# EAGLE schematic esp_thermometer (EAGLE 9.3.2)
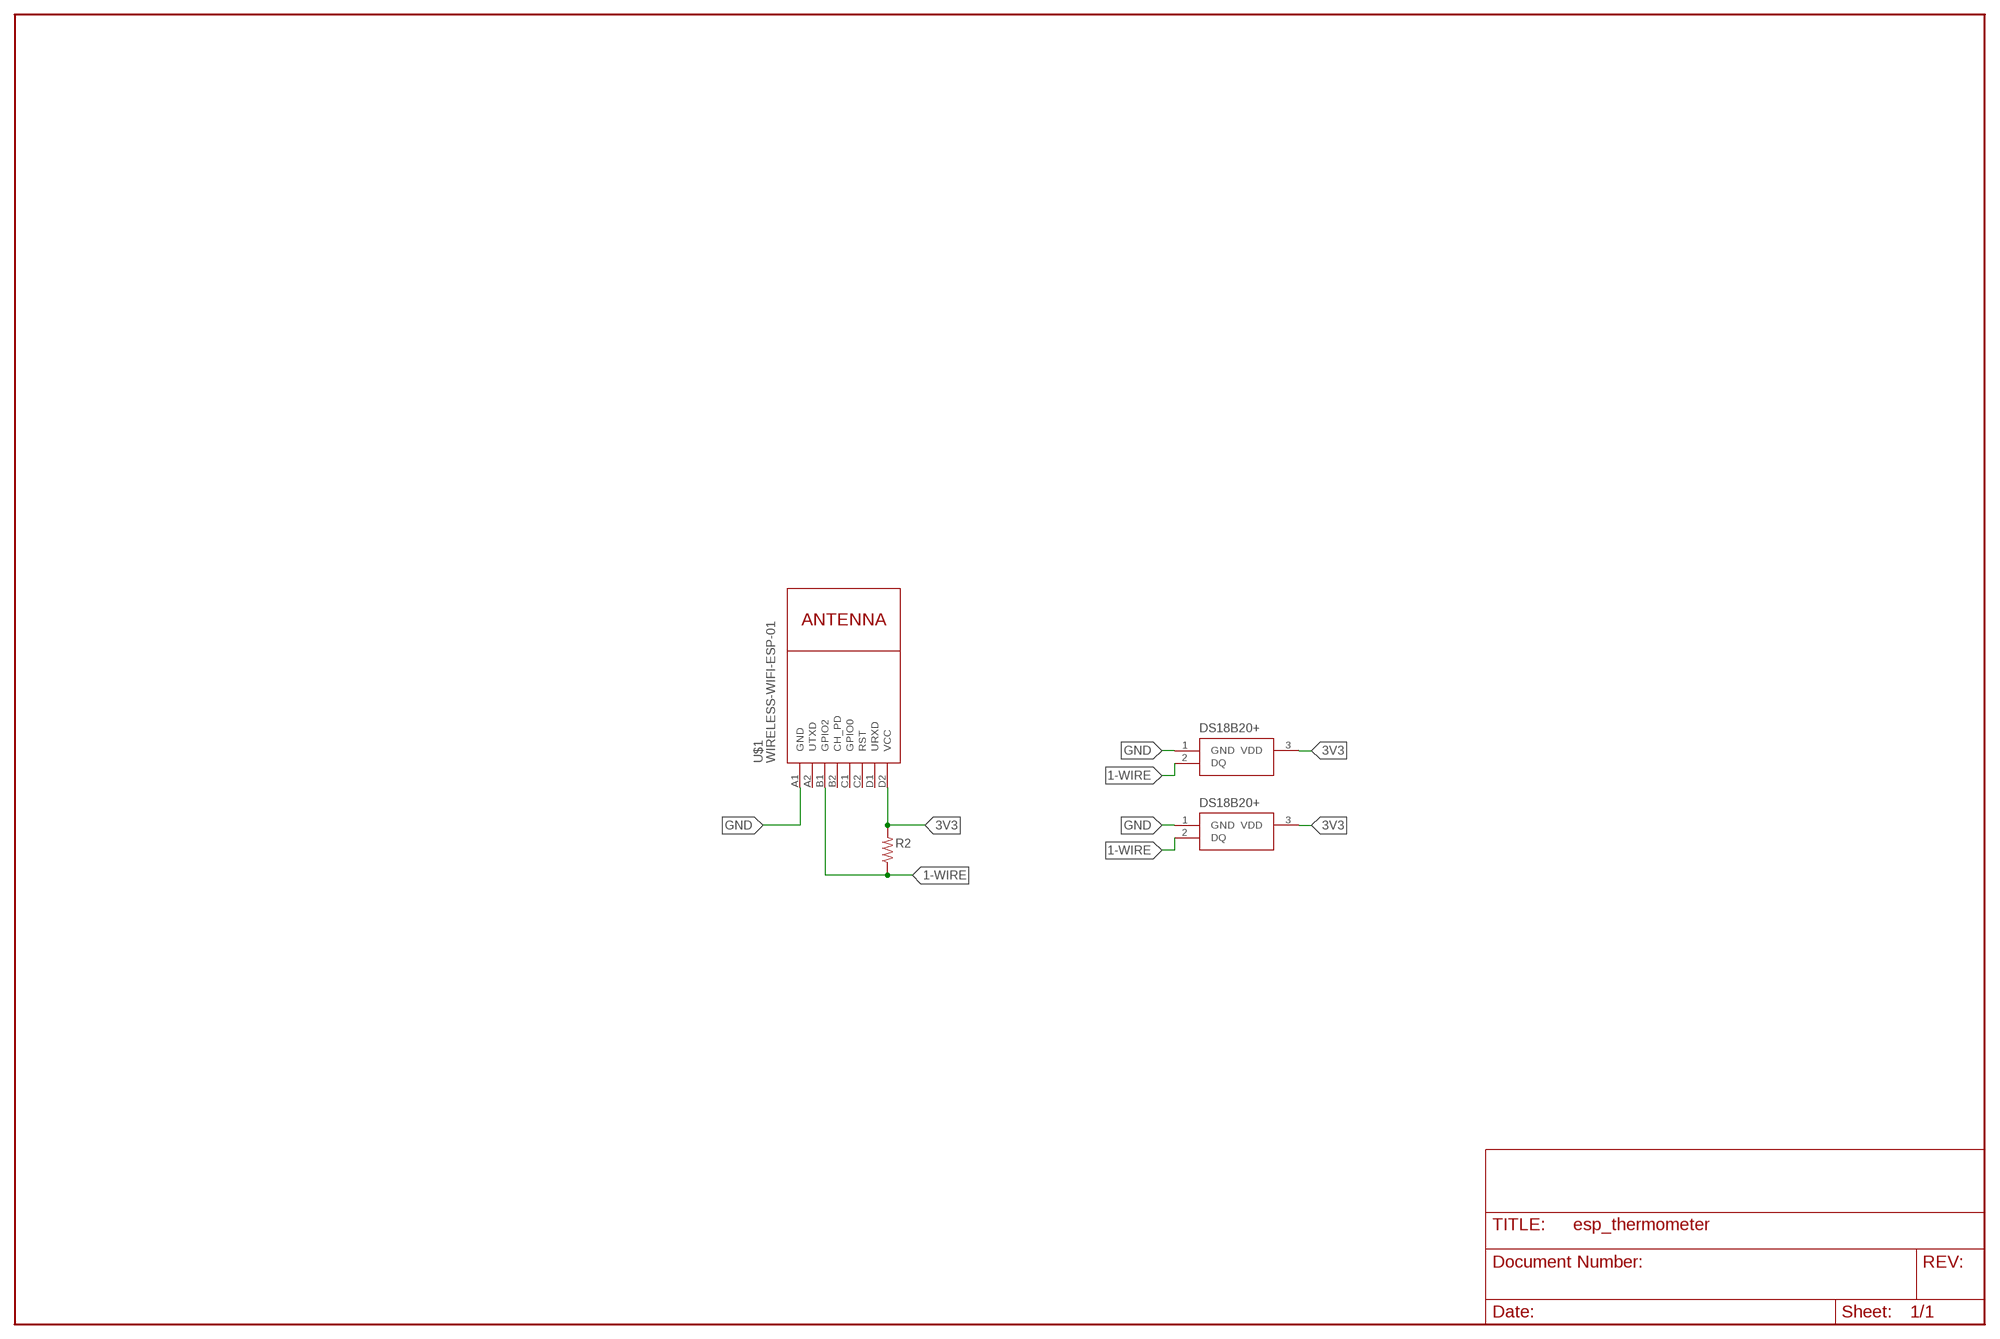
[diagram p0: schematic, sheet 1]

## Parts
IC2  DS18B20+  [TO-92]
IC3  DS18B20+  [TO-92]
R2  R-US_0204/7  [0204/7]
U$1  WIRELESS-WIFI-ESP-01  [WIRELESS-WIFI-ESP-01]

## Nets
1-WIRE: IC2.2(DQ) IC3.2(DQ)
3V3: IC2.3(VDD)
GND: IC2.1(GND) IC3.1(GND)
N$1: U$1.A1(GND)
N$4: IC3.3(VDD)
N$12: R2.1 U$1.B1(GPIO2)
N$13: R2.2 U$1.D2(VCC)
Unconnected: U$1.A2(UTXD) U$1.B2(CH_PD) U$1.C1(GPIO0) U$1.C2(RST) U$1.D1(URXD)

## Library data of the parts
IC2 IC3 = SamacSys_Parts:DS18B20+: DS18B20 prog thermometer 1-Wire, TO92 Source: Datasheet <https://componentsearchengine.com/Datasheets/1/DS18B20 .pdf>; DESCRIPTION: DS18B20 prog thermometer 1-Wire, TO92; HEIGHT: mm; MANUFACTURER_NAME: Maxim Integrated; MANUFACTURER_PART_NUMBER: DS18B20+; MOUSER_PART_NUMBER: 700-DS18B20+; MOUSER_PRICE-STOCK: https://www.mouser.com/Search/Refine.aspx?Keyword=700-DS18B20%2B
R2 = adafruit:R-US_: RESISTOR, American symbol
U$1 = diy-modules:WIRELESS-WIFI-ESP-01: Wireless Wi-Fi ESP-01 Module based on ESP8266 chip